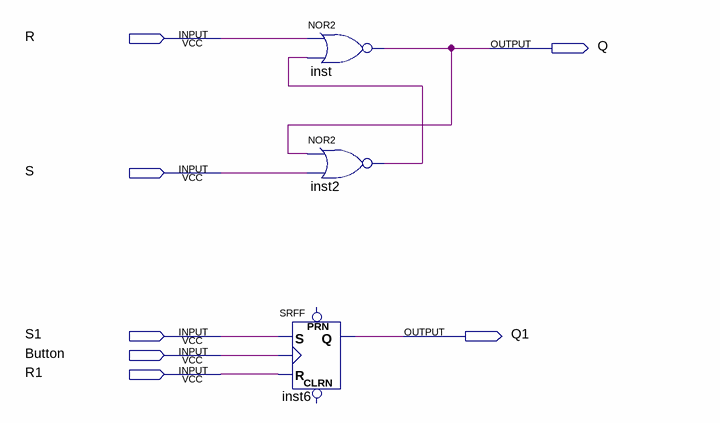
[diagram p0: schematic sheet]
// Quartus schematic lab4.bdf as structural Verilog: 3 symbols, 7 pins
module lab4 (
  input  R,
  input  S,
  input  S1,
  input  Button,
  input  R1,
  output Q,
  output Q1
);

  wire inst2_out;

  nor inst (Q, R, inst2_out);
  nor inst2 (inst2_out, Q, S);
  SRFF inst6 (.S(S1), .R(R1), .CLK(Button), .Q(Q1));  // open: PRN, CLRN
endmodule
